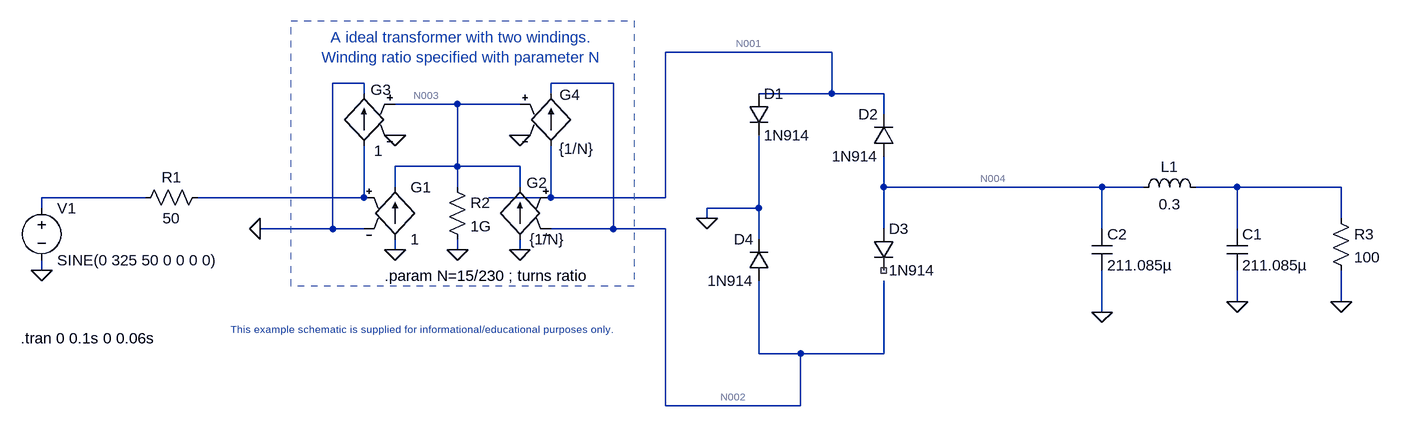
[diagram p0: schematic PI_filter2withRectifier.asc]
PI_filter2withRectifier.asc, the LTspice schematic file:
Version 4
SHEET 1 1108 680
WIRE 256 -144 0 -144
WIRE -464 -96 -512 -96
WIRE -80 -96 -176 -96
WIRE -464 -80 -464 -96
WIRE -176 -80 -176 -96
WIRE 256 -80 256 -144
WIRE 256 -80 144 -80
WIRE 336 -80 256 -80
WIRE -320 -64 -416 -64
WIRE -224 -64 -320 -64
WIRE 336 -48 336 -80
WIRE -320 32 -320 -64
WIRE -320 32 -416 32
WIRE -224 32 -320 32
WIRE -416 64 -416 32
WIRE -320 64 -320 32
WIRE -224 64 -224 32
WIRE 336 64 336 16
WIRE 672 64 336 64
WIRE 736 64 672 64
WIRE 880 64 816 64
WIRE 1040 64 880 64
WIRE -800 80 -960 80
WIRE -464 80 -464 0
WIRE -464 80 -720 80
WIRE -176 80 -176 0
WIRE -176 80 -272 80
WIRE 0 80 0 -144
WIRE 0 80 -176 80
WIRE -960 96 -960 80
WIRE 144 96 144 -16
WIRE 144 96 64 96
WIRE 64 112 64 96
WIRE 1040 112 1040 64
WIRE -512 128 -512 -96
WIRE -512 128 -624 128
WIRE -464 128 -512 128
WIRE -80 128 -80 -96
WIRE -80 128 -176 128
WIRE 0 128 -80 128
WIRE 336 128 336 64
WIRE 672 128 672 64
WIRE 880 128 880 64
WIRE 144 144 144 96
WIRE -416 160 -416 144
WIRE -320 160 -320 144
WIRE -224 160 -224 144
WIRE -960 192 -960 176
WIRE 880 240 880 192
WIRE 1040 240 1040 192
WIRE 672 256 672 192
WIRE 144 320 144 208
WIRE 208 320 144 320
WIRE 336 320 336 208
WIRE 336 320 208 320
WIRE 0 400 0 128
WIRE 208 400 208 320
WIRE 208 400 0 400
FLAG -960 192 0
FLAG -224 160 0
FLAG -416 160 0
FLAG -416 -16 0
FLAG -224 -16 0
FLAG -320 160 0
FLAG -624 128 0
FLAG 64 112 0
FLAG 880 240 0
FLAG 1040 240 0
FLAG 672 256 0
SYMBOL voltage -960 80 R0
WINDOW 123 0 0 Left 0
WINDOW 39 0 0 Left 0
SYMATTR InstName V1
SYMATTR Value SINE(0 325 50 0 0 0 0)
SYMBOL res -704 64 R90
WINDOW 0 0 56 VBottom 2
WINDOW 3 32 56 VTop 2
SYMATTR InstName R1
SYMATTR Value 50
SYMBOL g -416 48 R0
SYMATTR InstName G1
SYMATTR Value 1
SYMBOL g -224 48 M0
WINDOW 0 -10 9 Right 2
WINDOW 3 -15 96 Right 2
SYMATTR InstName G2
SYMATTR Value {1/N}
SYMBOL g -464 -96 M0
WINDOW 0 -10 10 Right 2
WINDOW 3 -16 104 Right 2
SYMATTR InstName G3
SYMATTR Value 1
SYMBOL g -176 -96 R0
WINDOW 0 13 18 Left 2
WINDOW 3 12 101 Left 2
SYMATTR InstName G4
SYMATTR Value {1/N}
SYMBOL res -336 48 R0
SYMATTR InstName R2
SYMATTR Value 1G
SYMBOL diode 128 -80 R0
SYMATTR InstName D1
SYMATTR Value 1N914
SYMBOL diode 352 16 R180
WINDOW 0 24 64 Left 2
WINDOW 3 24 0 Left 2
SYMATTR InstName D2
SYMATTR Value 1N914
SYMBOL diode 320 128 R0
SYMATTR InstName D3
SYMATTR Value 1N914
SYMBOL diode 160 208 R180
WINDOW 0 24 64 Left 2
WINDOW 3 24 0 Left 2
SYMATTR InstName D4
SYMATTR Value 1N914
SYMBOL cap 864 128 R0
SYMATTR InstName C1
SYMATTR Value 211.085µ
SYMBOL res 1024 96 R0
SYMATTR InstName R3
SYMATTR Value 100
SYMBOL ind 720 80 R270
WINDOW 0 32 56 VTop 2
WINDOW 3 5 56 VBottom 2
SYMATTR InstName L1
SYMATTR Value 0.3
SYMBOL cap 656 128 R0
SYMATTR InstName C2
SYMATTR Value 211.085µ
TEXT -384 272 Top 1 ;This example schematic is supplied for informational/educational purposes only.
TEXT -312 -120 Bottom 2 ;A ideal transformer with two windings.\nWinding ratio specified with parameter N
TEXT -432 200 Left 2 !.param N=15/230 ; turns ratio
TEXT -992 296 Left 2 !.tran 0 0.1s 0 0.06s
RECTANGLE Normal -48 216 -576 -192 2

The netlist it stands for:
* PI_filter2withRectifier.asc
V1 N006 0 SINE(0 325 50 0 0 0 0)
R1 N007 N006 50
G1 0 N003 N007 0 1
G2 0 N003 N001 N002 {1/N}
G3 N007 0 N003 0 1
G4 N001 N002 N003 0 {1/N}
R2 N003 0 1G
D1 N001 0 1N914
D2 N004 N001 1N914
D3 N004 NC_01 1N914
D4 N002 0 1N914
C1 N005 0 211.085µ
R3 N005 0 100
L1 N004 N005 0.3
C2 N004 0 211.085µ
.model D D
.lib standard.dio
* This example schematic is supplied for informational/educational purposes only.
* A ideal transformer with two windings.
* Winding ratio specified with parameter N
.param N=15/230 ; turns ratio
.tran 0 0.1s 0 0.06s
.backanno
.end

* Results of the author's LTspice run, read from the files saved beside the schematic
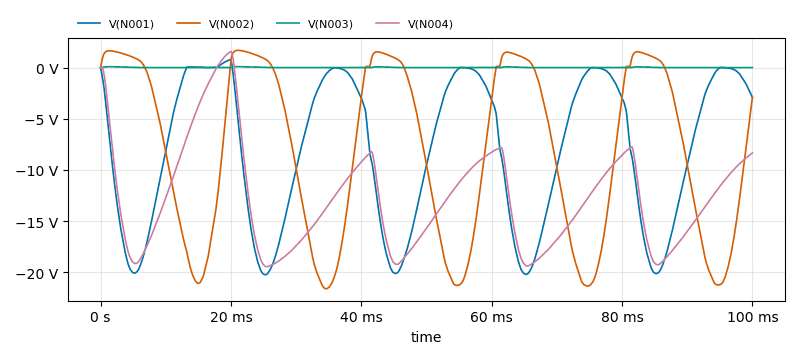
[diagram p1: Transient Analysis of PI_filter2withRectifier.asc, plotted from the saved traces]
* Transient Analysis, 1 run:
*   V(N001): min -20.24 V, max 778.1 mV, average -8.087 V, rms 10.94 V, last -2.899 V
*   V(N002): min -21.6 V, max 1.682 V, average -8.107 V, rms 11.76 V, last -2.899 V
*   V(N003): min -114.8 nV, max 88.46 mV, average 11.21 mV, rms 26.12 mV, last 0 V
*   V(N004): min -19.45 V, max 1.566 V, average -12.75 V, rms 13.73 V, last -8.33 V